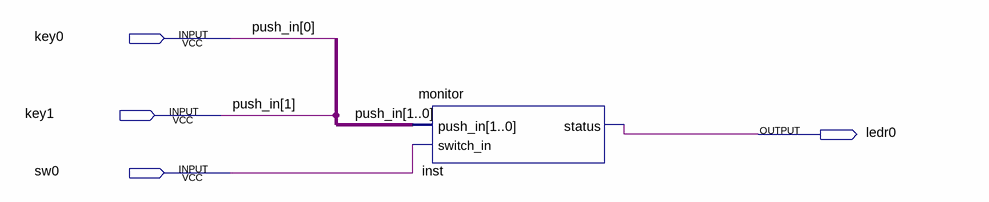
[diagram p0: schematic sheet]
// Quartus schematic monitor_tb.bdf as structural Verilog: 1 symbols, 4 pins
module monitor_tb (
  input  key0,
  input  key1,
  input  sw0,
  output ledr0
);

  monitor inst (.push_in({key1, key0}), .switch_in(sw0), .status(ledr0));

  // Other names for the same wires on the sheet: push_in[1:0] = {key1, key0}
endmodule
